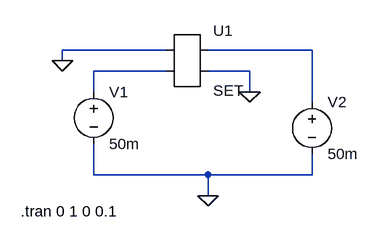
[diagram p0: schematic simulacionset2.asc]
simulacionset2.asc, the LTspice schematic file:
Version 4
SHEET 1 880 680
WIRE 208 128 48 128
WIRE 432 128 272 128
WIRE 48 144 48 128
WIRE 208 160 96 160
WIRE 336 160 272 160
WIRE 96 192 96 160
WIRE 336 192 336 160
WIRE 432 208 432 128
WIRE 96 320 96 272
WIRE 272 320 96 320
WIRE 432 320 432 288
WIRE 432 320 272 320
WIRE 272 352 272 320
FLAG 48 144 0
FLAG 272 352 0
FLAG 336 192 0
SYMBOL AutoGenerated\\SET 240 144 R0
SYMATTR InstName U1
SYMBOL voltage 96 176 R0
WINDOW 123 0 0 Left 0
WINDOW 39 0 0 Left 0
SYMATTR InstName V1
SYMATTR Value 50m
SYMBOL voltage 432 192 R0
WINDOW 123 0 0 Left 0
WINDOW 39 0 0 Left 0
SYMATTR InstName V2
SYMATTR Value 50m
TEXT -16 376 Left 2 !.tran 0 1 0 0.1

The netlist it stands for:
* simulacionset2.asc
* U1: SET (symbol AutoGenerated\SET not available, pins judged from their places): pin1=0 pin2=N002 pin3=N001 pin4=0
V1 N002 0 50m
V2 N001 0 50m
.tran 0 1 0 0.1
.backanno
.end